# Altium project OTP2.PrjPCB
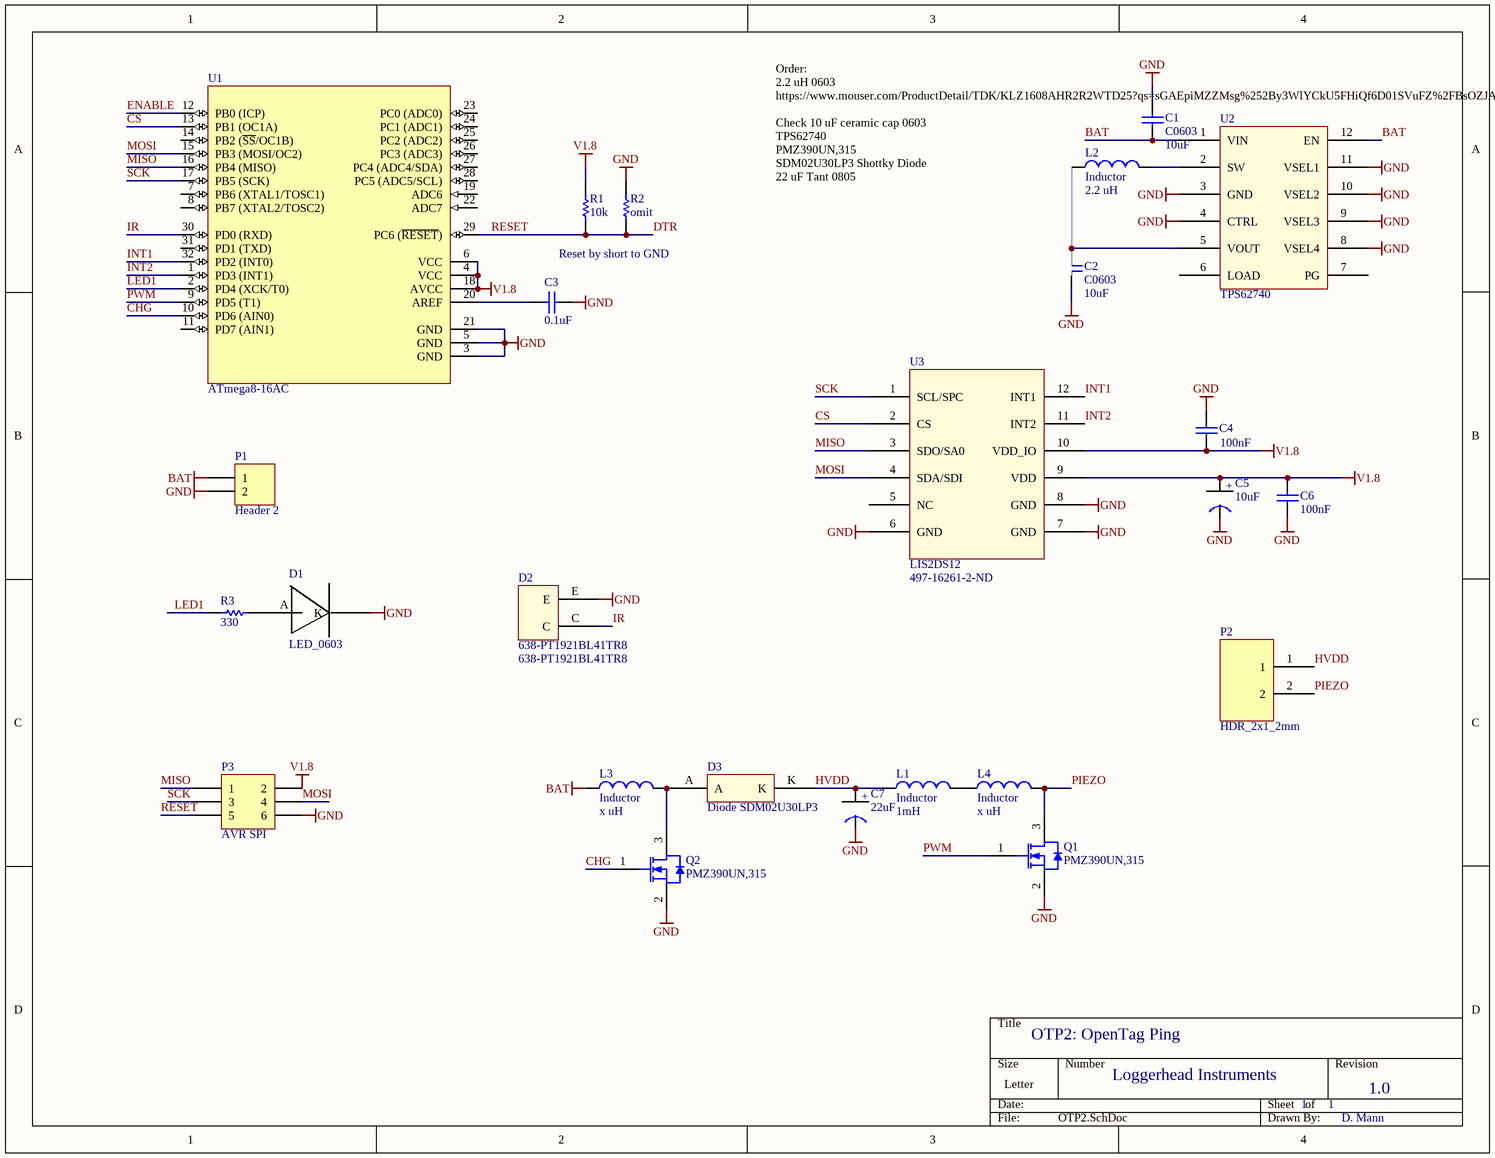
[diagram p0: OTP2.SchDoc]
1 sheet, 25 parts. Net scope: global (net labels, ports and power ports of the same name join across sheets).
Board file: OTP2.PcbDoc

## Sheet OTP2.SchDoc
size Letter

### Parts
C1  C0603  value 10uF  [0603]
C2  C0603  value 10uF  [0603]
C3  0.1uF  [0402]
C4  100nF  [0402]
C5  10uF  [Tant0805]
C6  100nF  [0402]
C7  22uF  [Tant0805]
D1  LED_0603  [Diode0603]
D2  638-PT1921BL41TR8  [Phototransistor]
D3  Diode SDM02U30LP3  [Diode SDM02U30LP3-7B]
L1  Inductor  value 1mH  [INDC3216]
L2  Inductor  value 2.2 uH  [0603]
L3  Inductor  value x uH  [0603]
L4  Inductor  value x uH  [0603]
P1  Header 2  [HDR1X2]
P2  HDR_2x1_2mm  [HDR_2x1_2mm]
P3  AVR SPI  [HDR2X3]
Q1  PMZ390UN,315  [NXP-SOT883_N]
Q2  PMZ390UN,315  [NXP-SOT883_N]
R1  10k  [3-0603]
R2  omit  [3-0603]
R3  330  [3-0603]
U1  ATmega8-16AC  [32M1-A_M]
U2  TPS62740  [TPS6274x]
U3  LIS2DS12  Supplier Part Number 1: 497-16261-2-ND  [LGA-12]

### Nets
BAT: C1.1 L3.1 P1.1 U2.1(VIN) U2.12(EN)
GND: C1.2 C2.1 C3.2 C4.2 C5.1(GND) C6.2 C7.1(GND) D1.K D2.E P1.2 P3.6 Q1.2(S) Q2.2(S) R2.2 U1.3(GND) U1.5(GND) U1.21(GND) U2.3(GND) U2.4(CTRL) U2.8(VSEL4) U2.9(VSEL3) U2.10(VSEL2) U2.11(VSEL1) U3.6(GND) U3.7(GND) U3.8(GND)
V1.8: C2.2 C4.1 C5.2(+) C6.1 L2.1 P3.2 R1.2 U1.4(VCC) U1.6(VCC) U1.18(AVCC) U2.5(VOUT) U3.9(VDD) U3.10(VDD_IO)
CHG: Q2.1(G) U1.10(PD6_(AIN0))
CS: U1.13(PB1_(OC1A)) U3.2(CS)
DTR: P3.5 R1.1 R2.1 U1.29(PC6_(~{RESET}))  [also labelled RESET]
ENABLE: U1.12(PB0_(ICP))
HVDD: C7.2(+) D3.K L1.1 P2.1
INT1: U1.32(PD2_(INT0)) U3.12(INT1)
INT2: U1.1(PD3_(INT1)) U3.11(INT2)
IR: D2.C U1.30(PD0_(RXD))
LED1: R3.1 U1.2(PD4_(XCK/T0))
MISO: P3.1 U1.16(PB4_(MISO)) U3.3(SDO/SA0)
MOSI: P3.4 U1.15(PB3_(MOSI/OC2)) U3.4(SDA/SDI)
PIEZO: L4.2 P2.2 Q1.3(D)
PWM: Q1.1(G) U1.9(PD5_(T1))
SCK: P3.3 U1.17(PB5_(SCK)) U3.1(SCL/SPC)
NetC3_1: C3.1 U1.20(AREF)
NetD1_A: D1.A R3.2
NetD3_A: D3.A L3.2 Q2.3(D)
NetL1_2: L1.2 L4.1
NetL2_2: L2.2 U2.2(SW)

Not connected (* = marked no-connect by the designer): U1 7(PB6_(XTAL1/TOSC1)) 8(PB7_(XTAL2/TOSC2)) 11(PD7_(AIN1)) 14(PB2_(~{SS}/OC1B)) 19(ADC6) 22(ADC7) 23(PC0_(ADC0)) 24(PC1_(ADC1)) 25(PC2_(ADC2)) 26(PC3_(ADC3)) 27(PC4_(ADC4/SDA)) 28(PC5_(ADC5/SCL)) 31(PD1_(TXD)); U2 6(LOAD) 7(PG); U3 5(NC)

### Notes on the sheet
- Reset by short to GND
- (near C2) Order:
  2.2 uH 0603 https://www.mouser.com/ProductDetail/TDK/KLZ1608AHR2R2WTD25?qs=sGAEpiMZZMsg%252By3WlYCkU5FHiQf6D01SVuFZ%2FBsOZJA%3D
  Check 10 uF ceramic cap 0603
  TPS62740
  PMZ390UN,315
  SDM02U30LP3 Shottky Diode
  22 uF Tant 0805
- OTP2: OpenTag Ping
- Loggerhead Instruments
- 1
- 1.0
- D. Mann

### Library data of the parts
C1 C2 = C0603: Ceramic Chip Capacitor - Standard; Note: Footprint corresponds to dimensions for bulk cassette packaging. This case size has tightened tolerances.; Published: 17-Jul-2002; LatestRevisionDate: 19-Mar-2004; LatestRevisionNote: Silkscreen size reduced.; DatasheetDocument: Mar-2001; PackageDocument: Mar-2001; PackageReference: 0603; Publisher: Altium Limited; Code_JEITA: 0603; Code_IPC: 1608 [0603]; ComponentLink1Description: Manufacturer Link; ComponentLink1URL: http://www.kemet.com/; ComponentLink2Description: Datasheet; ComponentLink2URL: http://www.kemet.com/kemet/web/homepage/kechome.nsf/vapubfilesname/F3102TA.pdf/$file/F3102TA.pdf
C3 = C0402: Ceramic Chip Capacitor - Standard; Note: Footprint corresponds to dimensions for bulk cassette packaging. This case size has tightened tolerances.; Published: 17-Jul-2002; LatestRevisionDate: 19-Mar-2004; LatestRevisionNote: Silkscreen size reduced.; DatasheetDocument: Mar-2001; PackageDocument: Mar-2001; PackageReference: 0402; Publisher: Altium Limited; Code_JEITA: 0402; Code_IPC: 1005 [0402]; ComponentLink1Description: Manufacturer Link; ComponentLink1URL: http://www.kemet.com/; ComponentLink2Description: Datasheet; ComponentLink2URL: http://www.kemet.com/kemet/web/homepage/kechome.nsf/vapubfilesname/F3102TA.pdf/$file/F3102TA.pdf; Value: 0.1uF
C4 C6 = C0402: Ceramic Chip Capacitor - Standard; Note: Footprint corresponds to dimensions for bulk cassette packaging. This case size has tightened tolerances.; Value: 100pF; Published: 17-Jul-2002; LatestRevisionDate: 19-Mar-2004; LatestRevisionNote: Silkscreen size reduced.; DatasheetDocument: Mar-2001; PackageDocument: Mar-2001; PackageReference: 0402; Publisher: Altium Limited; Code_JEITA: 0402; Code_IPC: 1005 [0402]; ComponentLink1Description: Manufacturer Link; ComponentLink1URL: http://www.kemet.com/; ComponentLink2Description: Datasheet; ComponentLink2URL: http://www.kemet.com/kemet/web/homepage/kechome.nsf/vapubfilesname/F3102TA.pdf/$file/F3102TA.pdf
C5 = Tant0805: Value: 10uF
C7 = Tant0805: Value: 10uF
D2 = Phototransistor: Supplier 1: Mouser; Supplier Part Number 1: 638-PT1921BL41TR8
D3 = Diode SDM02U30LP3: SDM02U30LP3
L1-L4 = Inductor: Code_IEC: 1005; Published: 8-Jun-2000; LatestRevisionDate: 29-May-2009; LatestRevisionNote: IPC-7351 Footprint Added.; PackageReference: 0402-A; Publisher: Altium Limited; PackageDescription: Chip Inductor; Code_JEITA: 0402
P1 = Header 2: Header, 2-Pin; LatestRevisionDate: 17-Jul-2002; LatestRevisionNote: Re-released for DXP Platform.; Publisher: Altium Limited
P3 = Header 3X2: Header, 3-Pin, Dual row; LatestRevisionDate: 17-Jul-2002; LatestRevisionNote: Re-released for DXP Platform.; Publisher: Altium Limited
Q1 Q2 = PMZ390UN,315: N-Channel TrenchMOS Standard Level FET, 30 V, 1.78 A, 3-Pin SOT883, Tape and Reel; Manufacturer: NXP Semiconductors; Channel Type: N; Ciss [typ] (pF): 43; Coss [typ] (pF): 7.7; ID [max] (A): 1.78; Packing: Tape & Reel; VDS [max] (V): 30; VGSth [typ] (V): 0.7; DatasheetVersion: Rev. 01; PackageVersion: 03-04-03, 04/2003; PackageReference: SOT883; PackageDescription: 3-Pin Small Outline No-Lead, Body 0.585 x 0.985 mm, Pitch 0.35 mm; Supplier 1: Digi-Key; Supplier Part Number 1: 568-7442-2-ND; Supplier 2: Digi-Key; Supplier Part Number 2: 568-7442-1-ND; Supplier 3: Digi-Key; Supplier Part Number 3: 568-7442-6-ND; Supplier 4: Farnell; Supplier Part Number 4: 1758121; Supplier 5: Newark; Supplier Part Number 5: 75R4841; Supplier 6: Mouser; Supplier Part Number 6: 771-PMZ390UN315; Mounting Technology: Surface Mount; Code_JEITA: SC-101; PartNumber: PMZ390UN,315; ComponentLink1Description: Manufacturer URL; ComponentLink1URL: http://www.nxp.com/; ComponentLink2Description: Datasheet; ComponentLink2URL: http://www.nxp.com/documents/data_sheet/PMZ390UN.pdf; ComponentLink3Description: Package Specification; ComponentLink3URL: http://www.nxp.com/documents/outline_drawing/sot883_po.pdf
R1-R3 = ERJ3RK: Precision Thick Film Chip Resistor, 10 Ohm to 1M Ohm Range, 1% and 0.5% Tolerance, 0603 Size, 0.063 W; Published: 17-Dec-2003; LatestRevisionDate: 19-Mar-2004; LatestRevisionNote: Silkscreen size reduced.; PackageDocument: Mar-2003; PackageReference: 3-0603; Publisher: Altium Limited; Code_IPC: 1608 [0603]; ComponentLink1Description: Manufacturer Link; ComponentLink1URL: http://www.panasonic.com/industrial/components/resistive_products.htm; ComponentLink2Description: Datasheet; ComponentLink2URL: http://www.panasonic.com/industrial/components/pdf/AOA0000CE2.pdf
U1 = ATmega8-16AC: 8-Bit AVR Microcontroller with 8K Bytes of In-System Programmable Flash Memory; Published: 17-Sep-2003; LatestRevisionDate: 13-Apr-2006; LatestRevisionNote: IPC-7351 Footprint Added.; DatasheetVersion: 2486H-AVR-09/02; PackageVersion: revB, Oct-2001; PackageReference: 32A; Publisher: Altium Limited; PackageDescription: 32-Pin Thin Quad Flat Pack 0.8 mm Pitch; Code_JEDEC: MS-026-ABA; ComponentLink1Description: Manufacturer Link; ComponentLink1URL: http://www.atmel.com; ComponentLink2Description: Datasheet; ComponentLink2URL: http://www.atmel.com/dyn/resources/prod_documents/doc2486.pdf
U2 = TPS6274x: Supplier 1: Farnell
U3 = LIS2DS12: Supplier 1: Digi-Key